# EAGLE design capelet_nrf52 (EAGLE 9.5.2)
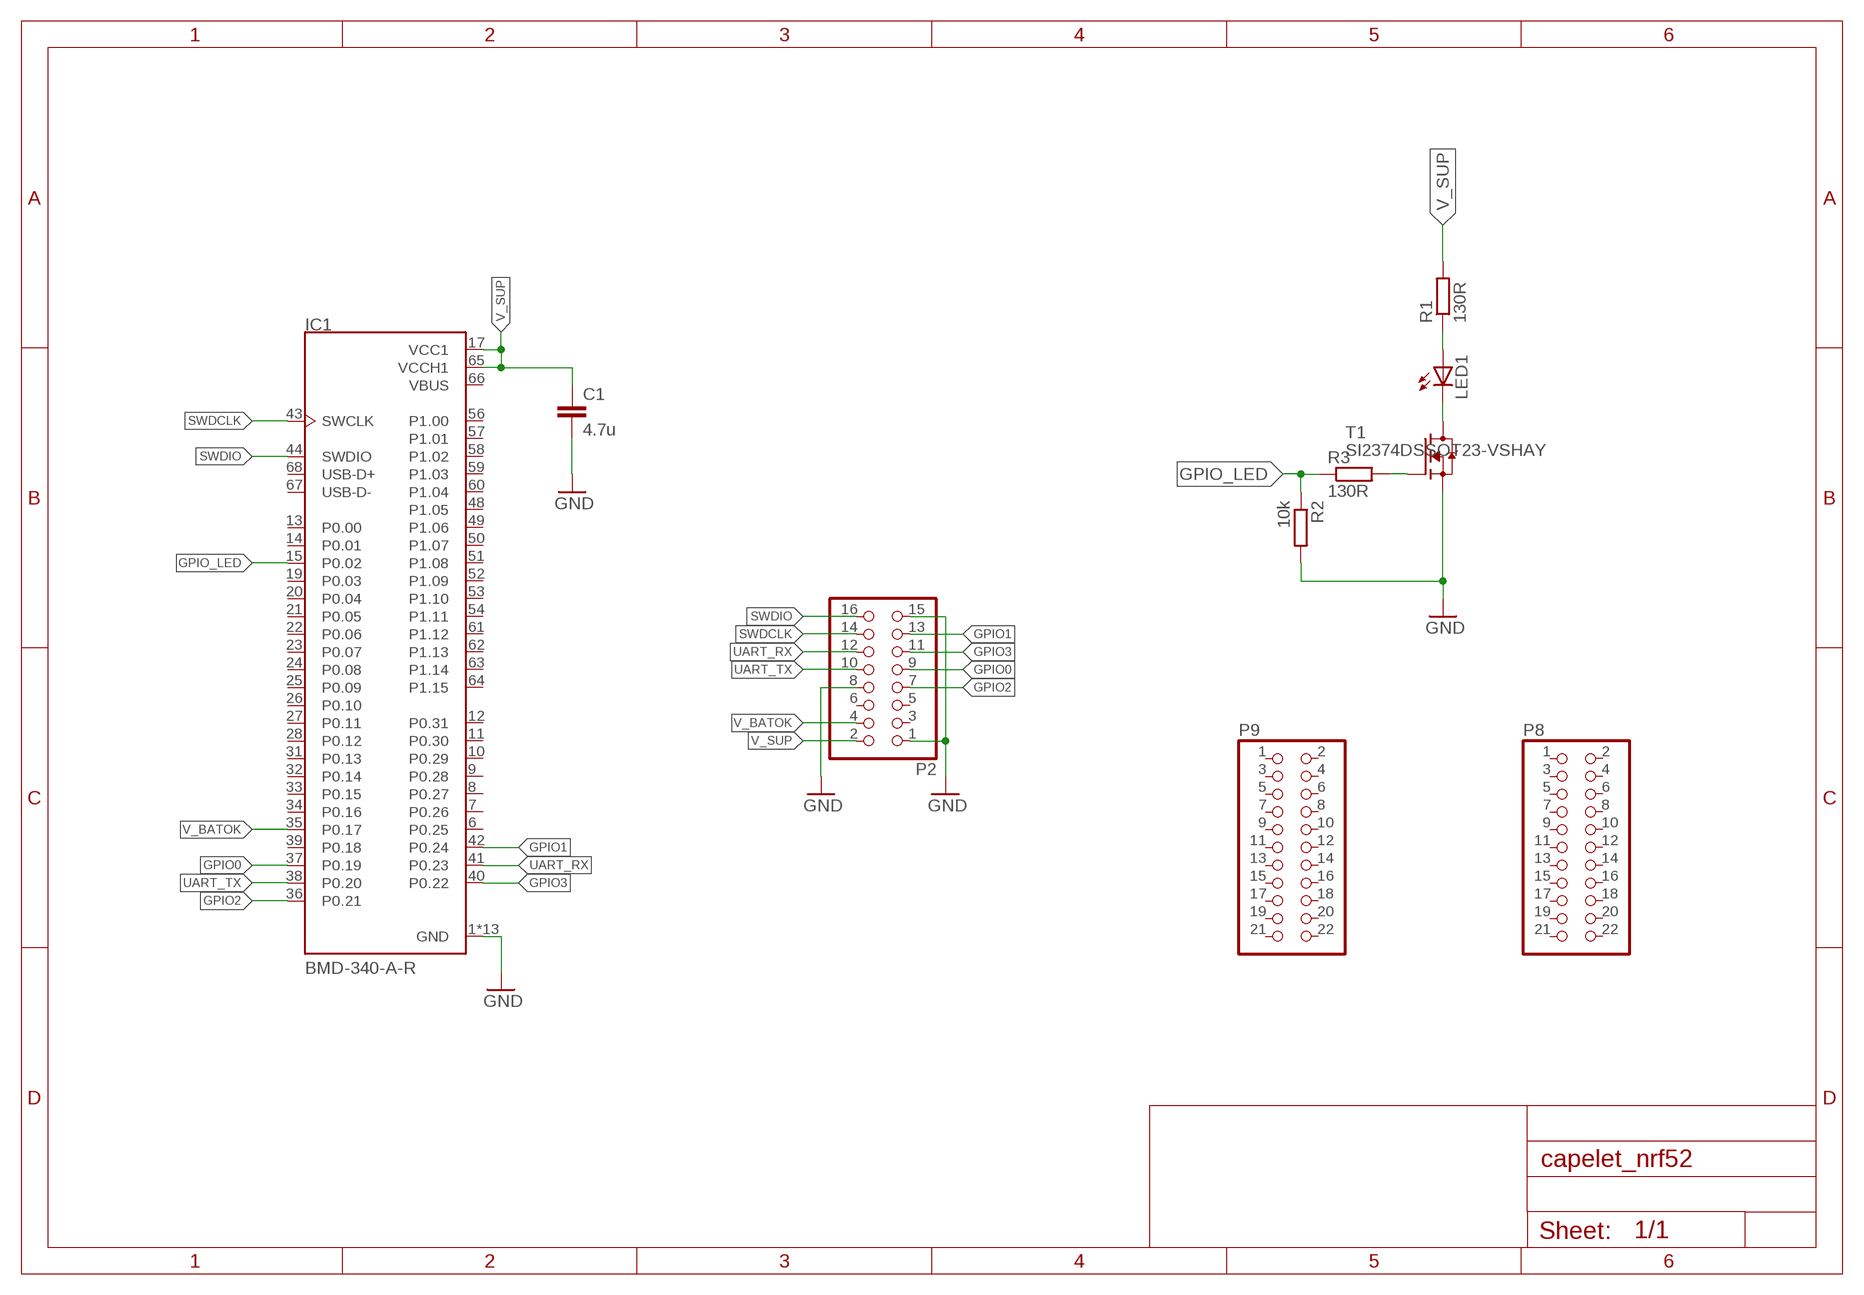
[diagram p0: schematic, sheet 1]

## Parts
C1  4.7u  C_SMD0603  [CAPC1608X95]
IC1  BMD-340-A-R  [RIGADO_BMD-340-A-R]
LED1  598-8130-107FLED_0805  [LEDC2012X75]
P2  PINHD-2X8  [2X08]
P8  PINHD-2X11  [2X11]
P9  PINHD-2X11  [2X11]
R1  130R  R_SMD0805  [RESC2012X65]
R2  10k  R_SMD0805  [RESC2012X65]
R3  130R  R_SMD0805  [RESC2012X65]
T1  SI2374DSSOT23-VSHAY  [SOT95P237X112-3]

## Nets
GND: C1.2 IC1.1(GND) IC1.2(GND) IC1.3(GND) IC1.4(GND) IC1.5(GND) IC1.16(GND) IC1.18(GND) IC1.29(GND) IC1.30(GND) IC1.45(GND) IC1.46(GND) IC1.47(GND) IC1.55(GND) P2.1 P2.8 P2.15 R2.2 T1.2(S)
GPIO0: IC1.37(P0.19) P2.9
GPIO1: IC1.42(P0.24) P2.13
GPIO2: IC1.36(P0.21) P2.7
GPIO3: IC1.40(P0.22) P2.11
GPIO_LED: IC1.15(P0.02) R2.1 R3.1
N$1: R3.2 T1.1(G)
N$3: LED1.1(C) T1.3(D)
N$4: LED1.2(A) R1.1
SWDCLK: IC1.43(SWCLK) P2.14
SWDIO: IC1.44(SWDIO) P2.16
UART_RX: IC1.41(P0.23) P2.12
UART_TX: IC1.38(P0.20) P2.10
V_BATOK: IC1.35(P0.17) P2.4
V_SUP: C1.1 IC1.17(VCC1) IC1.65(VCCH1) P2.2 R1.2
Unconnected: IC1.6(P0.25) IC1.7(P0.26) IC1.8(P0.27) IC1.9(P0.28) IC1.10(P0.29) IC1.11(P0.30) IC1.12(P0.31) IC1.13(P0.00) IC1.14(P0.01) IC1.19(P0.03) IC1.20(P0.04) IC1.21(P0.05) IC1.22(P0.06) IC1.23(P0.07) IC1.24(P0.08) IC1.25(P0.09) IC1.26(P0.10) IC1.27(P0.11) IC1.28(P0.12) IC1.31(P0.13) IC1.32(P0.14) IC1.33(P0.15) IC1.34(P0.16) IC1.39(P0.18) IC1.48(P1.05) IC1.49(P1.06) IC1.50(P1.07) IC1.51(P1.08) IC1.52(P1.09) IC1.53(P1.10) IC1.54(P1.11) IC1.56(P1.00) IC1.57(P1.01) IC1.58(P1.02) IC1.59(P1.03) IC1.60(P1.04) IC1.61(P1.12) IC1.62(P1.13) IC1.63(P1.14) IC1.64(P1.15) IC1.67(USB-D-) IC1.68(USB-D+) P2.3 P2.5 P2.6 P8.1 P8.2 P8.3 P8.4 P8.5 P8.6 P8.7 P8.8 P8.9 P8.10 P8.11 P8.12 P8.13 P8.14 P8.15 P8.16 P8.17 P8.18 P8.19 P8.20 P8.21 P8.22 P9.1 P9.2 P9.3 P9.4 P9.5 P9.6 P9.7 P9.8 P9.9 P9.10 P9.11 P9.12 P9.13 P9.14 P9.15 P9.16 P9.17 P9.18 P9.19 P9.20 P9.21 P9.22

## Power pins joined to a net without a drawn wire
VBUS: IC1.66(VBUS)

## Library data of the parts
C1 = shepherd:C_SMD
IC1 = shepherd:BMD-340-A-R: Bluetooth Low Energy 5.0 Module; DESCRIPTION: Bluetooth Low Energy 5.0 Module; MF: Rigado; MP: BMD-340-A-R; PACKAGE: None
LED1 = shepherd:598-8130-107F
P2 = pinhead:PINHD-2X8: PIN HEADER
P8 P9 = pinhead:PINHD-2X11: PIN HEADER
R1-R3 = shepherd:R_SMD
T1 = shepherd:SI2374DS

## Board
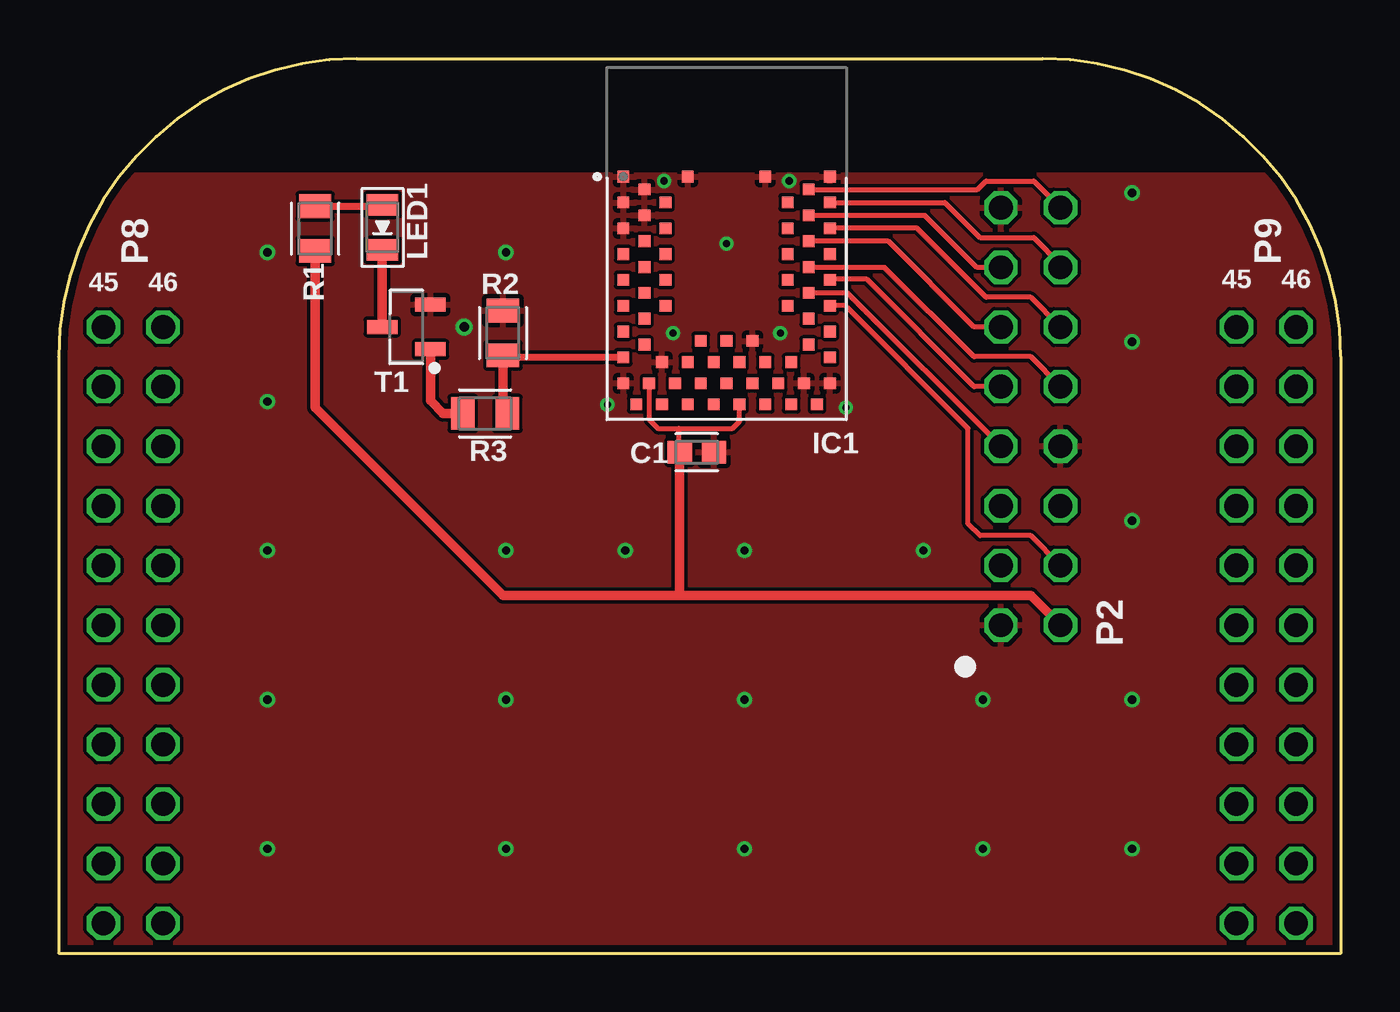
[diagram p1: board, top side]
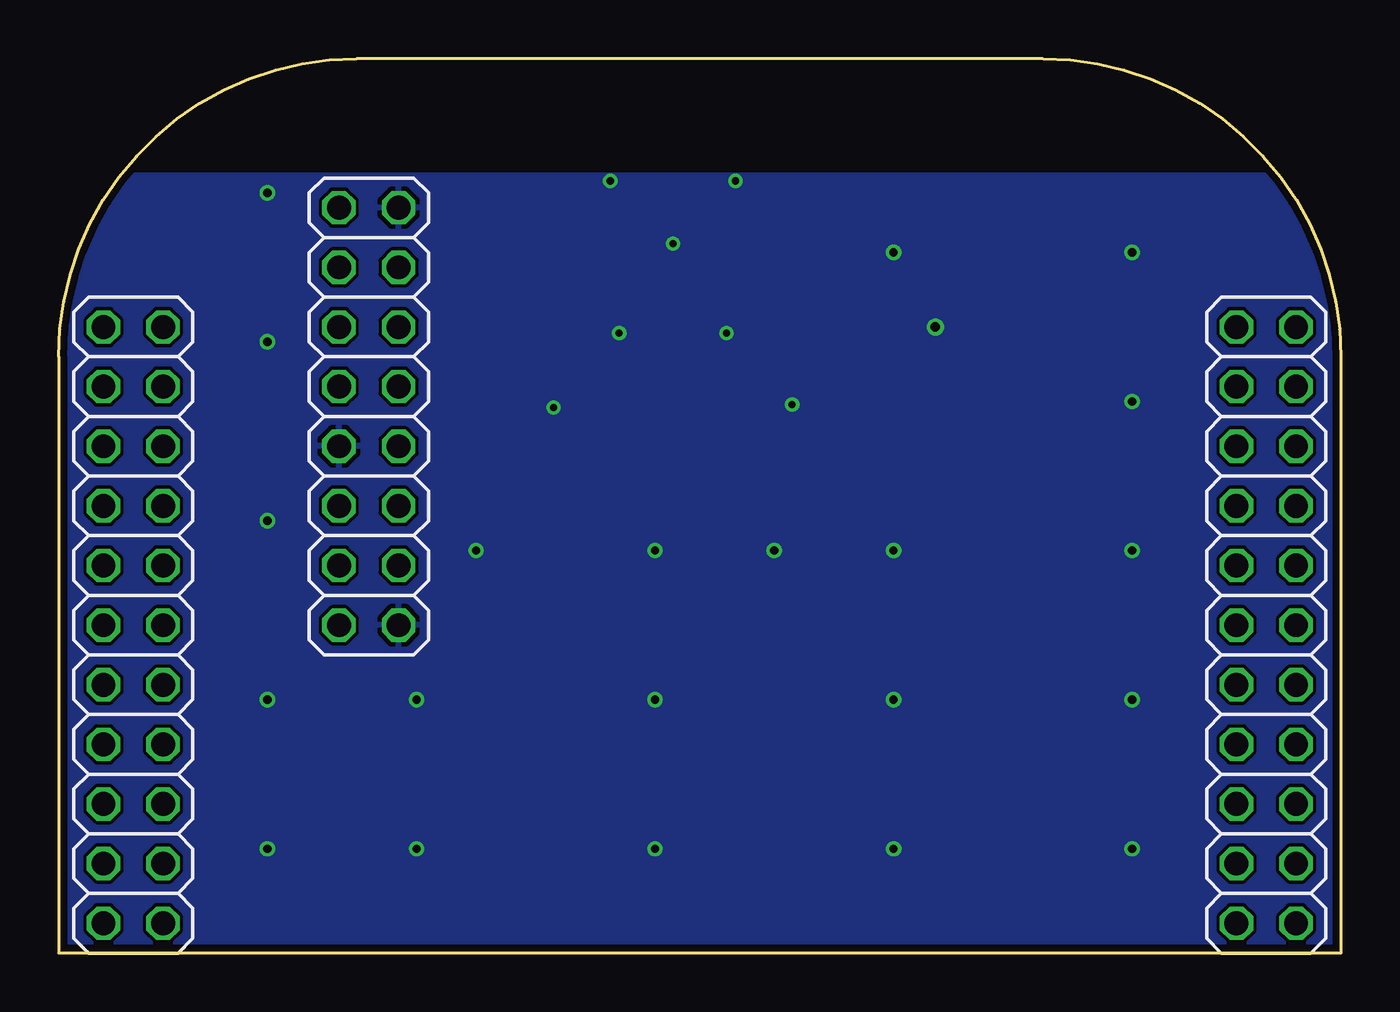
[diagram p2: board, bottom side, seen from below]

Size 54.61 x 38.1 mm. Coordinates in mm from the lower left corner, seen from the top.
Copper layers (1*16): Top 0.035mm / dielectric 1.5mm / Bottom 0.035mm
Design rules "PCB-POOL Standard *": minimum track width 0.15mm, minimum drill 0.3mm, track to track 0.15mm, track to pad 0.15mm, pad to pad 0.15mm, via to via 0.15mm, smd to smd 0.15mm, copper to edge 0.3mm, drill to drill 0.2mm, minimum pad ring 0.2mm, minimum via ring 0.15mm, stop-mask expansion 0.03mm, vias tented up to drill 30mil, thermal gap 0.2mm

### Footprints (pad centres in the part's own frame; a part is rotated, then mirrored left to right if it is on the bottom)
CAPC1608X95 = smd 1.024 x 0.954: 1 -0.725,0; 2 0.725,0
RIGADO_BMD-340-A-R = smd 0.5 x 0.5: 1 -2.85,-4.4; 2 -2.3,-3.5; 3 -1.75,-4.4; 4 -1.2,-3.5; 5 -0.65,-4.4; 6 -0.1,-3.5; 7 0.45,-4.4; 8 1,-3.5; 9 1.55,-4.4; 10 2.1,-3.5; 11 2.65,-4.4; 12 3.2,-3.5; 13 3.75,-4.4; 14 4.3,-3.5; 15 4.85,-4.4; 16 5.95,-4.4; 17 5.95,-3.3; 18 5.05,-2.75; 19 5.95,-2.2; 20 5.05,-1.65; 21 5.95,-1.1; 22 5.05,-0.55; 23 5.95,0; 24 5.05,0.55; 25 5.95,1.1; 26 5.05,1.65; 27 5.95,2.2; 28 5.05,2.75; 29 5.95,3.3; 30 5.95,4.4; 31 4.85,4.4; 32 4.3,3.5; 33 3.75,4.4; 34 3.2,3.5; 35 2.65,4.4; 36 2.1,3.5; 37 1.55,4.4; 38 1,3.5; 39 0.45,4.4; 40 -0.1,3.5; 41 -0.65,4.4; 42 -1.2,3.5; 43 -1.75,4.4; 44 -2.3,3.5; 45 -2.85,4.4; 46 -2.85,1.65; 47 -2.85,-1.65; 48 -1.75,-2.6; 49 -0.65,-2.6; 50 0.45,-2.6; 51 1.55,-2.6; 52 2.65,-2.6; 53 4.15,-1.1; 54 4.15,0; 55 4.15,1.1; 56 2.65,2.6; 57 1.55,2.6; 58 0.45,2.6; 59 -0.65,2.6; 60 -1.75,2.6; 61 6.85,-3.85; 62 6.85,-2.75; 63 6.85,-1.65; 64 6.85,-0.55; 65 6.85,0.55; 66 6.85,1.65; 67 6.85,2.75; 68 6.85,3.85
LEDC2012X75 = smd 0.91 x 1.35: 1 -0.96,0; 2 0.96,0
2X08 = drill 1.016 octagon: 1 -8.89,-1.27; 2 -8.89,1.27; 3 -6.35,-1.27; 4 -6.35,1.27; 5 -3.81,-1.27; 6 -3.81,1.27; 7 -1.27,-1.27; 8 -1.27,1.27; 9 1.27,-1.27; 10 1.27,1.27; 11 3.81,-1.27; 12 3.81,1.27; 13 6.35,-1.27; 14 6.35,1.27; 15 8.89,-1.27; 16 8.89,1.27
2X11 = drill 1.016 octagon: 1 -12.7,-1.27; 2 -12.7,1.27; 3 -10.16,-1.27; 4 -10.16,1.27; 5 -7.62,-1.27; 6 -7.62,1.27; 7 -5.08,-1.27; 8 -5.08,1.27; 9 -2.54,-1.27; 10 -2.54,1.27; 11 0,-1.27; 12 0,1.27; 13 2.54,-1.27; 14 2.54,1.27; 15 5.08,-1.27; 16 5.08,1.27; 17 7.62,-1.27; 18 7.62,1.27; 19 10.16,-1.27; 20 10.16,1.27; 21 12.7,-1.27; 22 12.7,1.27
RESC2012X65 = smd 1.015 x 1.379: 1 -0.95,0; 2 0.95,0
SOT95P237X112-3 = smd 1.298 x 0.597: 1 -1.027,0.95; 2 -1.027,-0.95; 3 1.027,0

### Placement (x,y rotation side)
C1  27.18,21.34 0 top
IC1  28.45,30.23 270 top
LED1  13.79,30.91 90 top
P2  41.4,22.86 90 bottom
P8  3.18,13.97 90 bottom
P9  51.44,13.97 90 bottom
R1  10.92,30.86 270 top
R2  18.92,26.42 90 top
R3  18.16,22.99 180 top
T1  14.81,26.67 180 top
U$3  [SHPRD_CPLT_T]  0,0 0 top

### Tracks (layer width: path | path; a pad name or v marks a point on that pad's centre or on a via)
GND  (via drill 0.3, 0.35, 0.4)
  other vias: 17.27,26.67 26.16,26.42 30.73,26.42 25.78,32.89 31.12,32.89 28.45,30.23 33.53,23.24 23.37,23.37 8.89,23.5 8.89,4.45 8.89,17.15 19.05,4.45 29.21,4.45 39.37,4.45 45.72,4.45 45.72,10.8 45.72,18.42 45.72,26.04 45.72,32.39 8.89,10.8 19.05,10.8 29.21,10.8 39.37,10.8 29.21,17.15 19.05,17.15 8.89,29.85 19.05,29.85 24.13,17.15 36.83,17.15
  pour Top: 0,0 54.61,0 54.61,33.15 0,33.15
  pour Bottom: 0,0 0,33.15 54.61,33.15 54.61,0
GPIO0
  Top 0.203: P2.9 38.99,24.13 34.42,28.7 32.87,28.7 IC1.37
GPIO1
  Top 0.203: P2.13 39.12,29.21 36.91,31.42 IC1.42
GPIO2
  Top 0.203: P2.7 33.6,28.12 IC1.36
GPIO3
  Top 0.203: P2.11 38.99,26.67 35.33,30.33 IC1.40
GPIO_LED
  Top 0.305: R2.1 19.01,25.38 IC1.15
  Top 0.406: R3.1 18.92,23.18 R2.1
N$1
  Top 0.406: R3.2 16.38,22.99 15.84,23.54 T1.1
N$3
  Top 0.406: T1.3 13.78,29.94 LED1.1
N$4
  Top 0.305: R1.1 13.73,31.81 LED1.2
SWDCLK
  Top 0.203: IC1.43 37.75,31.98 39.24,30.48 41.53,30.48 42.67,29.34 P2.14
SWDIO
  Top 0.203: IC1.44 39.13,32.53 39.5,32.89 41.53,32.89 P2.16
UART_RX
  Top 0.203: P2.12 41.4,27.94 39.5,27.94 36.55,30.89 IC1.41
UART_TX
  Top 0.203: P2.10 41.4,25.4 38.99,25.4 35.18,29.21 31.96,29.21 IC1.38
V_BATOK
  Top 0.203: P2.4 41.4,17.78 39.24,17.78 38.73,18.29 38.73,22.35 33.51,27.58 IC1.35
V_SUP
  Top 0.203: IC1.17 25.15,22.74 25.15,22.73 25.53,22.35 26.42,22.35 | 26.42,22.35 28.7,22.35 29,22.65 IC1.65 | C1.1 26.42,21.37 26.42,22.35
  Top 0.406: R1.2 10.92,23.24 18.92,15.24 26.42,15.24 | P2.2 41.4,15.24 26.42,15.24 | C1.1 26.45,15.28 26.42,15.24

### Text on the board
tNames: 45 | 46 | 45 | 46
tStop: SHEPHERD v1.5 CAPELET NRF52
Document: P2: Pins pointing to bottom, solder on top | P8: Pins pointing to bottom, solder on top | P9: Pins pointing to bottom, solder on top